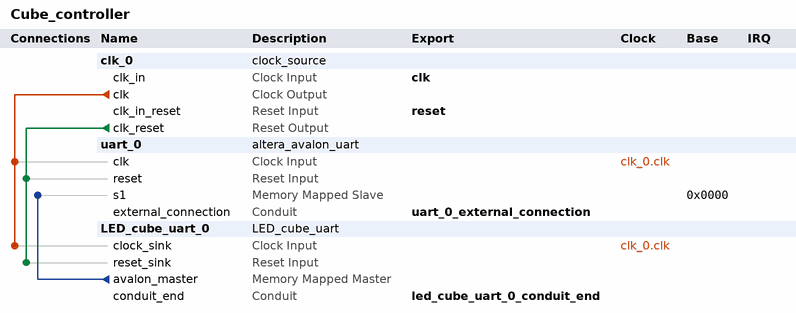
[diagram p0: system contents]
# Platform Designer (Qsys) system Cube_controller, Cyclone V 5CSEMA5F31C6
# Parameters at their usual value, and those the tool derives, are not listed.
package require -exact qsys 18.1
create_system Cube_controller
set_project_property DEVICE_FAMILY {Cyclone V}
set_project_property DEVICE 5CSEMA5F31C6

add_instance clk_0 clock_source 18.1
set_instance_parameter_value clk_0 clockFrequency 50000000

add_instance uart_0 altera_avalon_uart 18.1
set_instance_parameter_value uart_0 baud 115200
set_instance_parameter_value uart_0 dataBits 8
set_instance_parameter_value uart_0 fixedBaud true
set_instance_parameter_value uart_0 parity NONE
set_instance_parameter_value uart_0 stopBits 1

add_instance LED_cube_uart_0 LED_cube_uart 1.0

# connections
add_connection clk_0.clk LED_cube_uart_0.clock_sink clock
add_connection clk_0.clk uart_0.clk clock
add_connection clk_0.clk_reset LED_cube_uart_0.reset_sink reset
add_connection clk_0.clk_reset uart_0.reset reset
add_connection LED_cube_uart_0.avalon_master uart_0.s1 avalon
set_connection_parameter_value LED_cube_uart_0.avalon_master/uart_0.s1 baseAddress 0x0000

# exported interfaces
add_interface clk clock sink
set_interface_property clk EXPORT_OF clk_0.clk_in
add_interface led_cube_uart_0_conduit_end conduit end
set_interface_property led_cube_uart_0_conduit_end EXPORT_OF LED_cube_uart_0.conduit_end
add_interface reset reset sink
set_interface_property reset EXPORT_OF clk_0.clk_in_reset
add_interface uart_0_external_connection conduit end
set_interface_property uart_0_external_connection EXPORT_OF uart_0.external_connection

set_interconnect_requirement {$system} qsys_mm.clockCrossingAdapter HANDSHAKE
set_interconnect_requirement {$system} qsys_mm.enableEccProtection FALSE
set_interconnect_requirement {$system} qsys_mm.insertDefaultSlave FALSE
set_interconnect_requirement {$system} qsys_mm.maxAdditionalLatency 1

save_system Cube_controller.qsys
